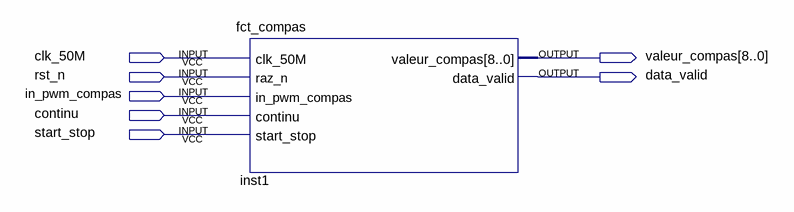
[diagram p0: schematic sheet]
// Quartus schematic schema1.bdf as structural Verilog: 1 symbols, 7 pins
module schema1 (
  input  clk_50M,
  input  rst_n,
  input  in_pwm_compas,
  input  continu,
  input  start_stop,
  output [8:0] valeur_compas,
  output data_valid
);

  fct_compas inst1 (
    .clk_50M(clk_50M), .raz_n(rst_n), .in_pwm_compas(in_pwm_compas), .continu(continu),
    .start_stop(start_stop), .valeur_compas(valeur_compas), .data_valid(data_valid));
endmodule
